# Altium schematic sheet main.SchDoc
size A3; SheetNumber: 1; SheetTotal: 1
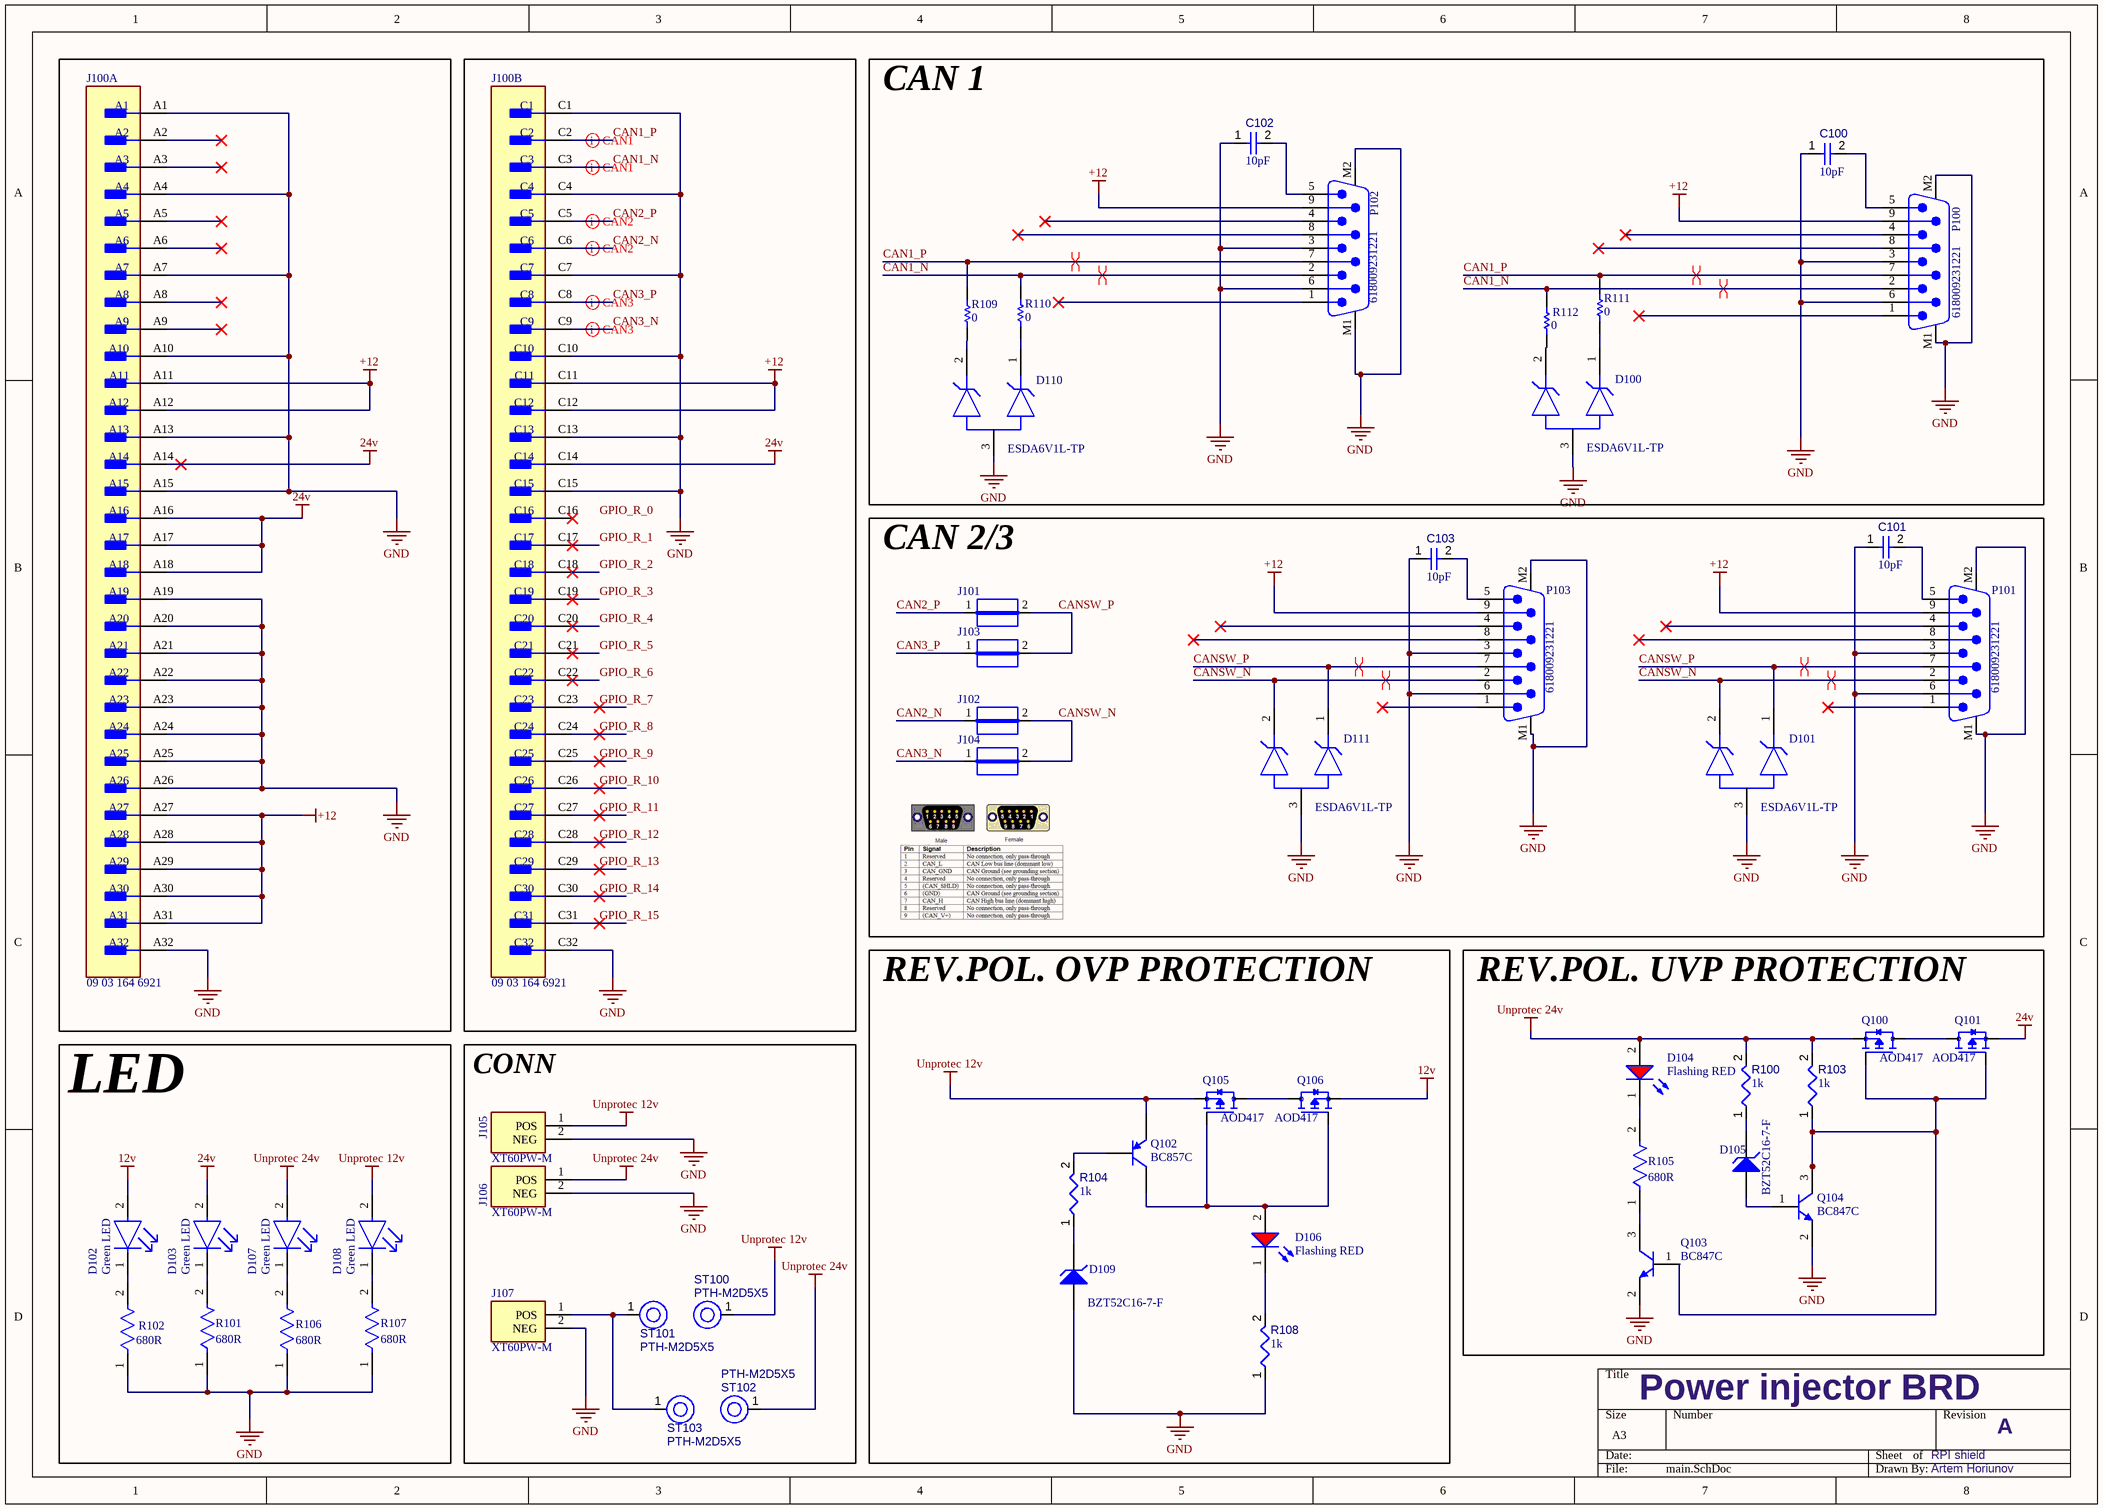
[diagram p0: main.SchDoc]

## Parts
C100  value 10pF  [CAPC1005X55X30LL05T10]  (hidden comment: Capacitor 10 pF +/- 0.25 pF 50 V 0402)
C101  value 10pF  [CAPC1005X55X30LL05T10]  (hidden comment: Capacitor 10 pF +/- 0.25 pF 50 V 0402)
C102  value 10pF  [CAPC1005X55X30LL05T10]  (hidden comment: Capacitor 10 pF +/- 0.25 pF 50 V 0402)
C103  value 10pF  [CAPC1005X55X30LL05T10]  (hidden comment: Capacitor 10 pF +/- 0.25 pF 50 V 0402)
D100  ESDA6V1L-TP  [FP-SOT-23-MFG]
D101  ESDA6V1L-TP  [FP-SOT-23-MFG]
D102  Green LED  [FP-HSME-C191-MFG]
D103  Green LED  [FP-HSME-C191-MFG]
D104  Flashing RED  [WL-SMCW_0805_150080xx75000]
D105  BZT52C16-7-F  [DIOD-SOD123-2_V]
D106  Flashing RED  [WL-SMCW_0805_150080xx75000]
D107  Green LED  [FP-HSME-C191-MFG]
D108  Green LED  [FP-HSME-C191-MFG]
D109  BZT52C16-7-F  [DIOD-SOD123-2_V]
D110  ESDA6V1L-TP  [FP-SOT-23-MFG]
D111  ESDA6V1L-TP  [FP-SOT-23-MFG]
J100  09 03 164 6921  [FP-09_03_164_6921-MFG]  (parts A,B of 2)
J101  JUMPER  [JUMPER]  (value not drawn)
J102  JUMPER  [JUMPER]  (value not drawn)
J103  JUMPER  [JUMPER]  (value not drawn)
J104  JUMPER  [JUMPER]  (value not drawn)
J105  XT60PW-M  [AMASS_XT60PW-M]
J106  XT60PW-M  [AMASS_XT60PW-M]
J107  XT60PW-M  [AMASS_XT60PW-M]
P100  618009231221  [618009231221]
P101  618009231221  [618009231221]
P102  618009231221  [618009231221]
P103  618009231221  [618009231221]
Q100  AOD417  [DPAK228P994X240_3N]
Q101  AOD417  [DPAK228P994X240_3N]
Q102  BC857C  [INF-SOT23_N]
Q103  BC847C  [INF-SOT23_L]
Q104  BC847C  [INF-SOT23_L]
Q105  AOD417  [DPAK228P994X240_3N]
Q106  AOD417  [DPAK228P994X240_3N]
R100  value 1k  [RESC1608X55X25ML10T15]  (hidden comment: Resistor 1k +/-1% 0603 100 mW)
R101  680R  [FP-CRCW0603-e3-MFG]
R102  680R  [FP-CRCW0603-e3-MFG]
R103  value 1k  [RESC1608X55X25ML10T15]  (hidden comment: Resistor 1k +/-1% 0603 100 mW)
R104  value 1k  [RESC1608X55X25ML10T15]  (hidden comment: Resistor 1k +/-1% 0603 100 mW)
R105  680R  [FP-CRCW0603-e3-MFG]
R106  680R  [FP-CRCW0603-e3-MFG]
R107  680R  [FP-CRCW0603-e3-MFG]
R108  value 1k  [RESC1608X55X25ML10T15]  (hidden comment: Resistor 1k +/-1% 0603 100 mW)
R109  value 0  [RESC1005X40X25ML05T10]  (hidden comment: Resistor 0R 0402 63 mW)
R110  value 0  [RESC1005X40X25ML05T10]  (hidden comment: Resistor 0R 0402 63 mW)
R111  value 0  [RESC1005X40X25ML05T10]  (hidden comment: Resistor 0R 0402 63 mW)
R112  value 0  [RESC1005X40X25ML05T10]  (hidden comment: Resistor 0R 0402 63 mW)
ST100  PTH-M2D5X5  [PTH-M2D5X5]
ST101  PTH-M2D5X5  [PTH-M2D5X5]
ST102  PTH-M2D5X5  [PTH-M2D5X5]
ST103  PTH-M2D5X5  [PTH-M2D5X5]

## Blocks framed on the sheet
CAN 1: C100 C102 D100 D110 P100 P102 R109-R112
CAN 2/3: C101 C103 D101 D111 J101-J104 P101 P103
REV.POL. OVP PROTECTION: D106 D109 Q102 Q105 Q106 R104 R108
REV.POL. UVP PROTECTION: D104 D105 Q100 Q101 Q103 Q104 R100 R103 R105
LED: D102 D103 D107 D108 R101 R102 R106 R107
CONN: J105-J107 ST100-ST103

## Nets
12v: D102.2(A) Q106.3(S)
24v: D103.2(A) J100.A14 J100.A16 J100.A17 J100.A18 J100.C14 Q101.3(S)
+12: J100.A11 J100.A12 J100.A27 J100.A28 J100.A29 J100.A30 J100.A31 J100.C11 J100.C12 P100.9 P101.9 P102.9 P103.9
GND: C100.1 C101.1 C102.1 C103.1 D100.3 D101.3 D109.1(A) D110.3 D111.3 J100.A1 J100.A4 J100.A7 J100.A10 J100.A13 J100.A15 J100.A19 J100.A20 J100.A21 J100.A22 J100.A23 J100.A24 J100.A25 J100.A26 J100.A32 J100.C1 J100.C4 J100.C7 J100.C10 J100.C13 J100.C15 J100.C32 J105.2(NEG) J106.2(NEG) J107.2(NEG) P100.3 P100.6 P100.M1 P100.M2 P101.3 P101.6 P101.M1 P101.M2 P102.3 P102.6 P102.M1 P102.M2 P103.3 P103.6 P103.M1 P103.M2 Q103.2(E) Q104.2(E) R101.1 R102.1 R106.1 R107.1 R108.1
Unprotec 12v: D108.2(A) J105.1(POS) Q102.2(E) Q105.3(S) ST100.1(H1)
Unprotec 24v: D104.2(A) D107.2(A) J106.1(POS) Q100.3(S) R100.2 R103.2 ST102.1(H1)
CAN1_N: J100.C3 P100.2 P102.2 R110.2 R112.2
CAN1_P: J100.C2 P100.7 P102.7 R109.2 R111.2
CAN2_N: J100.C6 J102.1
CAN2_P: J100.C5 J101.1
CAN3_N: J100.C9 J104.1
CAN3_P: J100.C8 J103.1
CANSW_N: D101.2 D111.2 J102.2 J104.2 P101.2 P103.2
CANSW_P: D101.1 D111.1 J101.2 J103.2 P101.7 P103.7
GPIO_R_1: J100.C17
GPIO_R_2: J100.C18
GPIO_R_3: J100.C19
GPIO_R_4: J100.C20
GPIO_R_5: J100.C21
GPIO_R_6: J100.C22
GPIO_R_7: J100.C23
GPIO_R_8: J100.C24
GPIO_R_9: J100.C25
GPIO_R_10: J100.C26
GPIO_R_11: J100.C27
GPIO_R_12: J100.C28
GPIO_R_13: J100.C29
GPIO_R_14: J100.C30
GPIO_R_15: J100.C31
NetC100_2: C100.2 P100.5
NetC101_2: C101.2 P101.5
NetC102_2: C102.2 P102.5
NetC103_2: C103.2 P103.5
NetD100_1: D100.1 R111.1
NetD100_2: D100.2 R112.1
NetD102_1: D102.1(C) R102.2
NetD103_1: D103.1(C) R101.2
NetD104_1: D104.1(K) R105.2
NetD105_1: D105.1(A) Q104.1(B)
NetD105_2: D105.2(K) R100.1
NetD106_1: D106.1(K) R108.2
NetD106_2: D106.2(A) Q102.3(C) Q105.1(G) Q106.1(G)
NetD107_1: D107.1(C) R106.2
NetD108_1: D108.1(C) R107.2
NetD109_2: D109.2(K) R104.1
NetD110_1: D110.1 R110.1
NetD110_2: D110.2 R109.1
NetJ107_1: J107.1(POS) ST101.1(H1) ST103.1(H1)
NetQ100_1: Q100.1(G) Q101.1(G) Q103.1(B) Q104.3(C) R103.1
NetQ100_4: Q100.4(D) Q101.4(D)
NetQ102_1: Q102.1(B) R104.2
NetQ103_3: Q103.3(C) R105.1
NetQ105_4: Q105.4(D) Q106.4(D)

Not connected (* = marked no-connect by the designer): J100 A2* A3* A5* A6* A8* A9* C16*; P100 1* 4* 8*; P101 1* 4* 8*; P102 1* 4* 8*; P103 1* 4* 8*

## Layout directives
differential pair: CAN1_N, CAN1_P, CAN2_N, CAN2_P, CAN3_N, CAN3_P
differential pair; differential pair class CAN: CAN1_N, CAN1_P, CANSW_N, CANSW_P

## Notes on the sheet
- Power injector BRD
- RPI shield
- A
- Artem Horiunov
- Labels drawn without touching a wire or pin: GPIO_R_0

## Library data of the parts
C100-C103 = CMP-001-00011-6: Chip Capacitor, 10 pF, +/- 0.25 pF, 50 V, 0402 (1005 Metric); Voltage Rating: 50V; Tolerance: 0.25%; Capacitor Type: Ceramic; Mounting Technology: SM; Pins: 2; Case/Package: 0402; Min Operating Temperature: -55°C; RoHS Compliant: True; Max Operating Temperature: 125°C
D100 D101 D110 D111 = CMP-56244-000002-1: TVS DIODE 5.25V SOT23; Power Dissipation: 300W; Direction: Unidirectional; Breakdown Voltage: 6.65V; Capacitance: 140pF; Element Configuration: Common Anode; Number of Channels: 2; Min Breakdown Voltage: 6.1V; Max Breakdown Voltage: 7.2V; Power Line Protection: No; Leakage Current: 20uA; Peak Pulse Power: 300W; Lead Free: Lead Free; Composition: Zener; Package Quantity: 1; Reverse Standoff Voltage: 5.25V; Working Voltage: 5.25V; Packaging: Tape and Reel; Case/Package: SOT-23; Mount: Surface Mount; Radiation Hardening: No; Number of Unidirectional Channels: 2; Number of Pins: 3; Max Operating Temperature: 150°C; Min Operating Temperature: -55°C; Depth: 1.4mm; Length: 3.04mm; Termination: SMD/SMT
D102 D103 D107 D108 = CMP-18399-000013-1: LED GREEN DIFFUSED 0603 SMD; Manufacturer: Broadcom; Manufacturer Part Number: HSME-C191; Forward Current: 20mA; Reverse Voltage: 5V; Forward Voltage: 2.1V; Viewing Angle: 170°; Wavelength: 572nm; Power Dissipation: 52mW; Max Junction Temp: +95°C; Luminous Intensity: 50mcd; Led Orientation: Top View; Peak Emmision Wavelength: 570nm; Package: 0; Category: Diode; ComponentLink2URL: https://docs.broadcom.com/docs/AV02-0976EN; ComponentLink2Description: Datasheet; Device Class L2: LEDs; Digikey Description: LED GREEN DIFFUSED 0603 SMD; Height: 0.7mm; RoHS: TRUE; Colour: Green; Lead Free: Yes; Device Class L1: Optoelectronics; Device Class L3: unset; Temperature Range High: +85°C; Automotive: No; Temperature: -40°C to +85°C; Octopart: https://octopart.com/hsme-c191-broadcom-71131261; Mouser Description: Standard LEDs - SMD AlInGaP Green; Temperature Range Low: -40°C
D104 D106 = CMP-1426-00010-4: Led, Red, 630 Nm, 1.9 V, 30 Ma, 60 Mcd Rohs Compliant: Yes; Reverse Voltage: 5V; Test Current: 20mA; Forward Current: 100mA; Power Dissipation: 72mW; Peak Wavelength: 645nm; Lens Style: Clear, Rectangular; Viewing Angle: 140°; Forward Voltage: 1.9V; Luminous Intensity: 60mcd; Wavelength: 630nm; Max Junction Temperature (Tj): 95°C; Color: Red; Case/Package: 0805; Length: 2mm; RoHS: Compliant; Max Operating Temperature: 85°C; Min Operating Temperature: -40°C; Case Code (Metric): 2012; Case Code (Imperial): 0805; Dominant Wavelength: 630nm; Max Reverse Voltage (DC): 5V; REACH SVHC: Unknown; Packaging: Tape and Reel; Mount: Surface Mount; Width: 1.25mm; Height: 700µm
D105 D109 = CMP-0860-00001-1: Surface Mount Zener Diode, 16 V, -65 to 125 degC, SOD123, RoHS, Tape and Reel; Manufacturer: Diodes Inc; Maximum Reverse Current: 0.1 uA; Tol V: 5.56% Typ.; Maximum Zener Impedance f: 1 kHz ZZK=200 Ohm; Voltage Zener: 16 V Typ.; Power Max: 500 mW; ComponentLink2URL: http://www.diodes.com/datasheets/ds18004.pdf; PackageDescription: 2-Pin SOD123, Body 2.7 x 1.55 mm, Height 1.45 mm; ComponentLink3Description: Package Specification; Mounting Technology: Surface Mount; PackageReference: SOD123; ComponentLink2Description: Datasheet; RoHS: TRUE; ComponentLink3URL: http://www.diodes.com/datasheets/ap02002.pdf; Operating Temperature: -65 to 150 degC; DatasheetVersion: Rev. 37-2; Packing: Tape and Reel; ComponentLink1Description: Manufacturer URL; ComponentLink1URL: http://www.diodes.com/; PackageVersion: Rev. 79; PartNumber: BZT52C16-7-F
J100 = CMP-33111-000001-1: CONN DIN HDR 96POS PCB RA; Manufacturer: Harting; Pitch: 2.54mm; Number Of Contacts: 64; Current Rating: 2A; Conn Orientation: Right Angle; Conn Gender: Male; Device Class L1: Connectors; Package: 0; Number Of Rows: 2; ComponentLink2URL: https://b2b.harting.com/files/download/PRD/PDF_DS/09031200203_100580339DRW000B.pdf; Height: 11mm; Temperature Range Low: -55°C; Digikey Description: CONN DIN HDR 96POS PCB RA; Mouser Description: Conn DIN 41612 M 64 POS 2.54mm Solder RA Thru-Hole Box; Footprint Url: https://b2b.harting.com/files/download/PRD/PDF_TS/0903164X921_100072506DRW176A.pdf; Lead Free: Yes; RoHS: TRUE; Device Class L2: Backplane Connectors; Category: Conn; Manufacturer Part Number: 09 03 164 6921; Temperature Range High: +125°C; Temperature: -55°C to +125°C; ComponentLink2Description: Datasheet; Octopart: https://octopart.com/09031646921-harting+elektronik-42933; Device Class L3: unset; Automotive: No; Contact Material: Gold,Nickel
J101-J104 = CMP-009-00061-2: Pins: 2
J105-J107 = CMP-002-00072-1: Socket, DC supply, male, PIN: 2; MF: AMASS; MP: XT60PW-M; Price: None; Component Type: Standard; Source: XT60PW-M.SchLib; SnapEDA_Link: https://www.snapeda.com/parts/XT60PW-M/AMASS/view-part/?ref=snap; Check_prices: https://www.snapeda.com/parts/XT60PW-M/AMASS/view-part/?ref=eda; Design Item ID: XT60PW-M; Value: *; Pins: 2; Availability: Not in stock; Case/Package: Package
P100-P103 = CMP-1502-00284-2: NexarPartId: 22865742; Pitch: 2.77mm; Number of Contacts: 9; Operating Supply Voltage: 125V; Insulation Resistance: 5GΩ; Gender: Male; Contact Resistance: 30mΩ; Current Rating: 3A; Mount: Through Hole; Housing Material: Steel; Contact Plating: Gold; Width: 12.5mm; Insulation Material: PBT; RoHS: Compliant; Depth: 18.5mm; Contact Material: Gold; Max Operating Temperature: 105°C; Min Operating Temperature: -55°C; Termination: SMD/SMT; Height: 12.7mm; Voltage Rating: 125V; Length: 30.8mm; Orientation: Right Angle; Number of Rows: 2; Number of Pins: 9; REACH SVHC: Unknown
Q100 Q101 Q105 Q106 = AOD417: P-Channel 30V 25A _Ta_ 2.5W _Ta_, 50W _Tc_ Surface Mount TO-252, _D-Pak_; MF: Alpha &; SnapEDA_Link: https://www.snapeda.com/parts/AOD417/Alpha%20%26%20Omega%20Semiconductor%20Inc./view-part/454934/?ref=snap; Availability: Unavailable; MP: AOD417; Price: None; Package: TO-252 Alpha &amp; Omega Semiconductor; Value: *
Q102 = CMP-1177-00039-1: PNP Silicon AF Transistor, 45 V VCEO, 100 mA IC, SOT23, Reel, Green; Manufacturer: Infineon; VCBO (max): 50Â V; fT (typ): 250Â MHz; ICBO (max): 15Â nA; IC (max): 100Â mA; Green: TRUE; IBM (max): 200Â mA; VEBO (max): 5Â V; VCEO (max): 45Â V; Ptot (max): 330Â mW; PackageDescription: 3-Pin Small Outline Transistor Package, 1.3 x 2.9 mm Body, 0.95 mm Pitch; ComponentLink2Description: Datasheet; PackageReference: SOT23; ComponentLink3Description: Package Specification; ComponentLink1URL: http://www.infineon.com/; ComponentLink1Description: Manufacturer URL; Mounting Technology: Surface Mount; PackageVersion: Apr-08; ComponentLink3URL: http://www.infineon.com/dgdl/SOT23-Package_Overview.pdf?folderId=db3a30431936bc4b0119532290053c66&fileId=db3a30431936bc4b0119533468123c85; ComponentLink2URL: http://www.infineon.com/dgdl/bc857series_bc858series_bc859series_bc860series.pdf?folderId=db3a304314dca389011541d30fa21656&fileId=db3a304314dca389011541da0e3a1661; Polarity: PNP; ICM (max): 200Â mA; PartNumber: BC857C; Packing: Reel
Q103 Q104 = CMP-1177-00037-1: NPN Silicon AF Transistor, 45 V VCEO, 100 mA IC, SOT23, Reel, Green; Manufacturer: Infineon; VCEO (max): 45Â V; VEBO (max): 6Â V; fT (typ): 250Â MHz; VCBO (max): 50Â V; ICM (max): 200Â mA; Green: TRUE; IC (max): 100Â mA; Ptot (max): 330Â mW; ICBO (max): 15Â nA; PartNumber: BC847C; ComponentLink3URL: http://www.infineon.com/dgdl/SOT23-Package_Overview.pdf?folderId=db3a30431936bc4b0119532290053c66&fileId=db3a30431936bc4b0119533468123c85; ComponentLink3Description: Package Specification; Mounting Technology: Surface Mount; PackageDescription: 3-Pin Small Outline Transistor Package, 1.3 x 2.9 mm Body, 0.95 mm Pitch; PackageReference: SOT23; ComponentLink2URL: http://www.infineon.com/dgdl/bc847series_bc848series_bc849series_bc850series.pdf?folderId=db3a304314dca389011541d30fa21656&fileId=db3a304314dca389011541d4630a1657; ComponentLink2Description: Datasheet; ComponentLink1Description: Manufacturer URL; Polarity: NPN; ComponentLink1URL: http://www.infineon.com/; IBM (max): 200Â mA; Packing: Reel; PackageVersion: Apr-08
R100 R103 R104 R108 = CMP-009-00014-5: Chip Resistor, 1 KOhm, +/-1%, 0.1 W, -55 to 155 degC, 0603 (1608 Metric); Voltage Rating: 50V; Power: 100mW; Tolerance: 1%; Mounting Technology: SM; Pins: 2; Case/Package: 0603; Min Operating Temperature: -55°C; RoHS Compliant: True; Max Operating Temperature: 155°C
R101 R102 R105-R107 = CMP-2000-03529-2: RES Thick Film, 680Ω, 1%, 0.1W, 100ppm/°C, 0603; Voltage Rating (DC): 75V; Max Power Dissipation: 100mW; Radiation Hardening: No; Case Code (Imperial): 0603; Number of Pins: 2; Termination: SMD/SMT; Lead Free: Lead Free; Contact Plating: Tin; Case Code (Metric): 1608; Max Operating Temperature: 155°C; Tolerance: 1%; Military Standard: Not; Features: Automotive AEC-Q200; Power Rating: 100mW; Width: 0.85mm; Depth: 0.85mm; Resistance: 680R; Height: 0.45mm; Case/Package: 0603; Min Operating Temperature: -55°C; Length: 1.55mm; Voltage Rating: 75V; Composition: Thick Film; Working Voltage: 75V; Temperature Coefficient: 100ppm/°C; Packaging: Tape and Reel; Package Quantity: 10; Weight: 7.1E-05oz; Number of Terminations: 2
R109-R112 = CMP-009-00004-5: Chip Resistor, 0 Ohm, 0.063 W, -55 to 155 degC, 0402 (1005 Metric); Power: 63mW; Voltage Rating: 50V; Max Operating Temperature: 155°C; Pins: 2; RoHS Compliant: True; Min Operating Temperature: -55°C; Mounting Technology: SM; Case/Package: 0402
ST100-ST103 = CMP-00028-00004-2: M2 PTH (2.5mm), 5mm pad; Pins: 1